# Altium schematic sheet SCH_Connect.SchDoc
size A4; DocumentNumber: 1; SheetNumber: 1; SheetTotal: 6
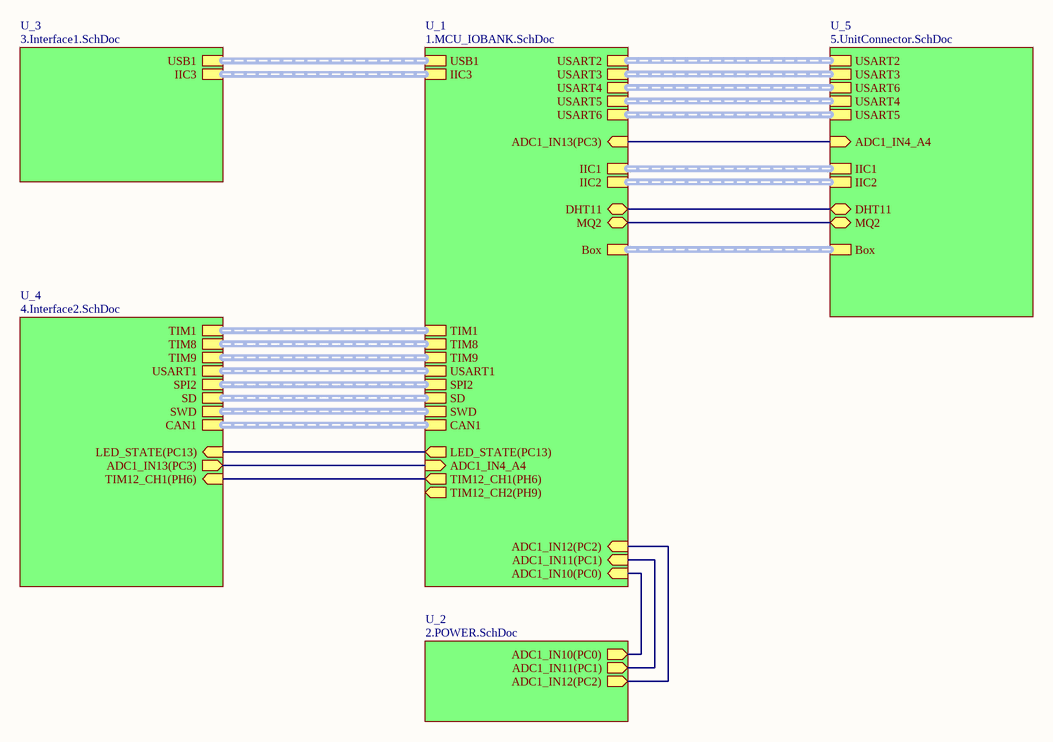
[diagram p0: SCH_Connect.SchDoc]

## Sub-sheets
U_1 = 1.MCU_IOBANK.SchDoc: TIM12_CH1(PH6) (out), TIM12_CH2(PH9) (out), LED_STATE(PC13) (out), ADC1_IN10(PC0) (in), ADC1_IN11(PC1) (in), ADC1_IN12(PC2) (in), ADC1_IN13(PC3) (in), TIM1 (harness TIM1), TIM8 (harness TIM8), USART1 (harness USART1), TIM9 (harness TIM9), SPI2 (harness SPI2), SD (harness SD), USART2 (harness USART2), USART3 (harness USART3), USART6 (harness USART6), SWD (harness SWD), CAN1 (harness CAN1), USB1 (harness USB1), ADC1_IN4_A4 (in), USART4 (harness USART4), USART5 (harness USART5), IIC1 (harness IIC1), IIC2 (harness IIC2), DHT11 (bidir), MQ2 (bidir), IIC3 (harness IIC3), Box (harness Box)
U_2 = 2.POWER.SchDoc: ADC1_IN10(PC0) (out), ADC1_IN11(PC1) (out), ADC1_IN12(PC2) (out)
U_3 = 3.Interface1.SchDoc: USB1 (harness USB1), IIC3 (harness IIC3)
U_4 = 4.Interface2.SchDoc: TIM12_CH1(PH6) (in), ADC1_IN13(PC3) (out), TIM1 (harness TIM1), TIM8 (harness TIM8), USART1 (harness USART1), TIM9 (harness TIM9), SPI2 (harness SPI2), LED_STATE(PC13) (in), SD (harness SD), SWD (harness SWD), CAN1 (harness CAN1)
U_5 = 5.UnitConnector.SchDoc: USART2 (harness USART2), USART3 (harness USART3), USART6 (harness USART6), ADC1_IN4_A4 (in), USART4 (harness USART4), USART5 (harness USART5), IIC1 (harness IIC1), IIC2 (harness IIC2), DHT11 (bidir), MQ2 (bidir), Box (harness Box)

## Nets
(unnamed): sheet U_1/TIM12_CH1(PH6), sheet U_4/TIM12_CH1(PH6)
(unnamed): sheet U_1/LED_STATE(PC13), sheet U_4/LED_STATE(PC13)
(unnamed): sheet U_1/ADC1_IN10(PC0), sheet U_2/ADC1_IN10(PC0)
(unnamed): sheet U_1/ADC1_IN11(PC1), sheet U_2/ADC1_IN11(PC1)
(unnamed): sheet U_1/ADC1_IN12(PC2), sheet U_2/ADC1_IN12(PC2)
(unnamed): sheet U_1/ADC1_IN13(PC3), sheet U_5/ADC1_IN4_A4
(unnamed): sheet U_1/ADC1_IN4_A4, sheet U_4/ADC1_IN13(PC3)
(unnamed): sheet U_1/DHT11, sheet U_5/DHT11
(unnamed): sheet U_1/MQ2, sheet U_5/MQ2

## Buses and harness runs
harness sheet U_1/Box = sheet U_5/Box
harness sheet U_1/CAN1 = sheet U_4/CAN1
harness sheet U_1/IIC1 = sheet U_5/IIC1
harness sheet U_1/IIC2 = sheet U_5/IIC2
harness sheet U_1/IIC3 = sheet U_3/IIC3
harness sheet U_1/SD = sheet U_4/SD
harness sheet U_1/SPI2 = sheet U_4/SPI2
harness sheet U_1/SWD = sheet U_4/SWD
harness sheet U_1/TIM1 = sheet U_4/TIM1
harness sheet U_1/TIM8 = sheet U_4/TIM8
harness sheet U_1/TIM9 = sheet U_4/TIM9
harness sheet U_1/USART1 = sheet U_4/USART1
harness sheet U_1/USART2 = sheet U_5/USART2
harness sheet U_1/USART3 = sheet U_5/USART3
harness sheet U_1/USART4 = sheet U_5/USART6
harness sheet U_1/USART5 = sheet U_5/USART4
harness sheet U_1/USART6 = sheet U_5/USART5
harness sheet U_1/USB1 = sheet U_3/USB1